# EAGLE schematic dig_usb (EAGLE 6.6.0)

## Sheet 1 of 4
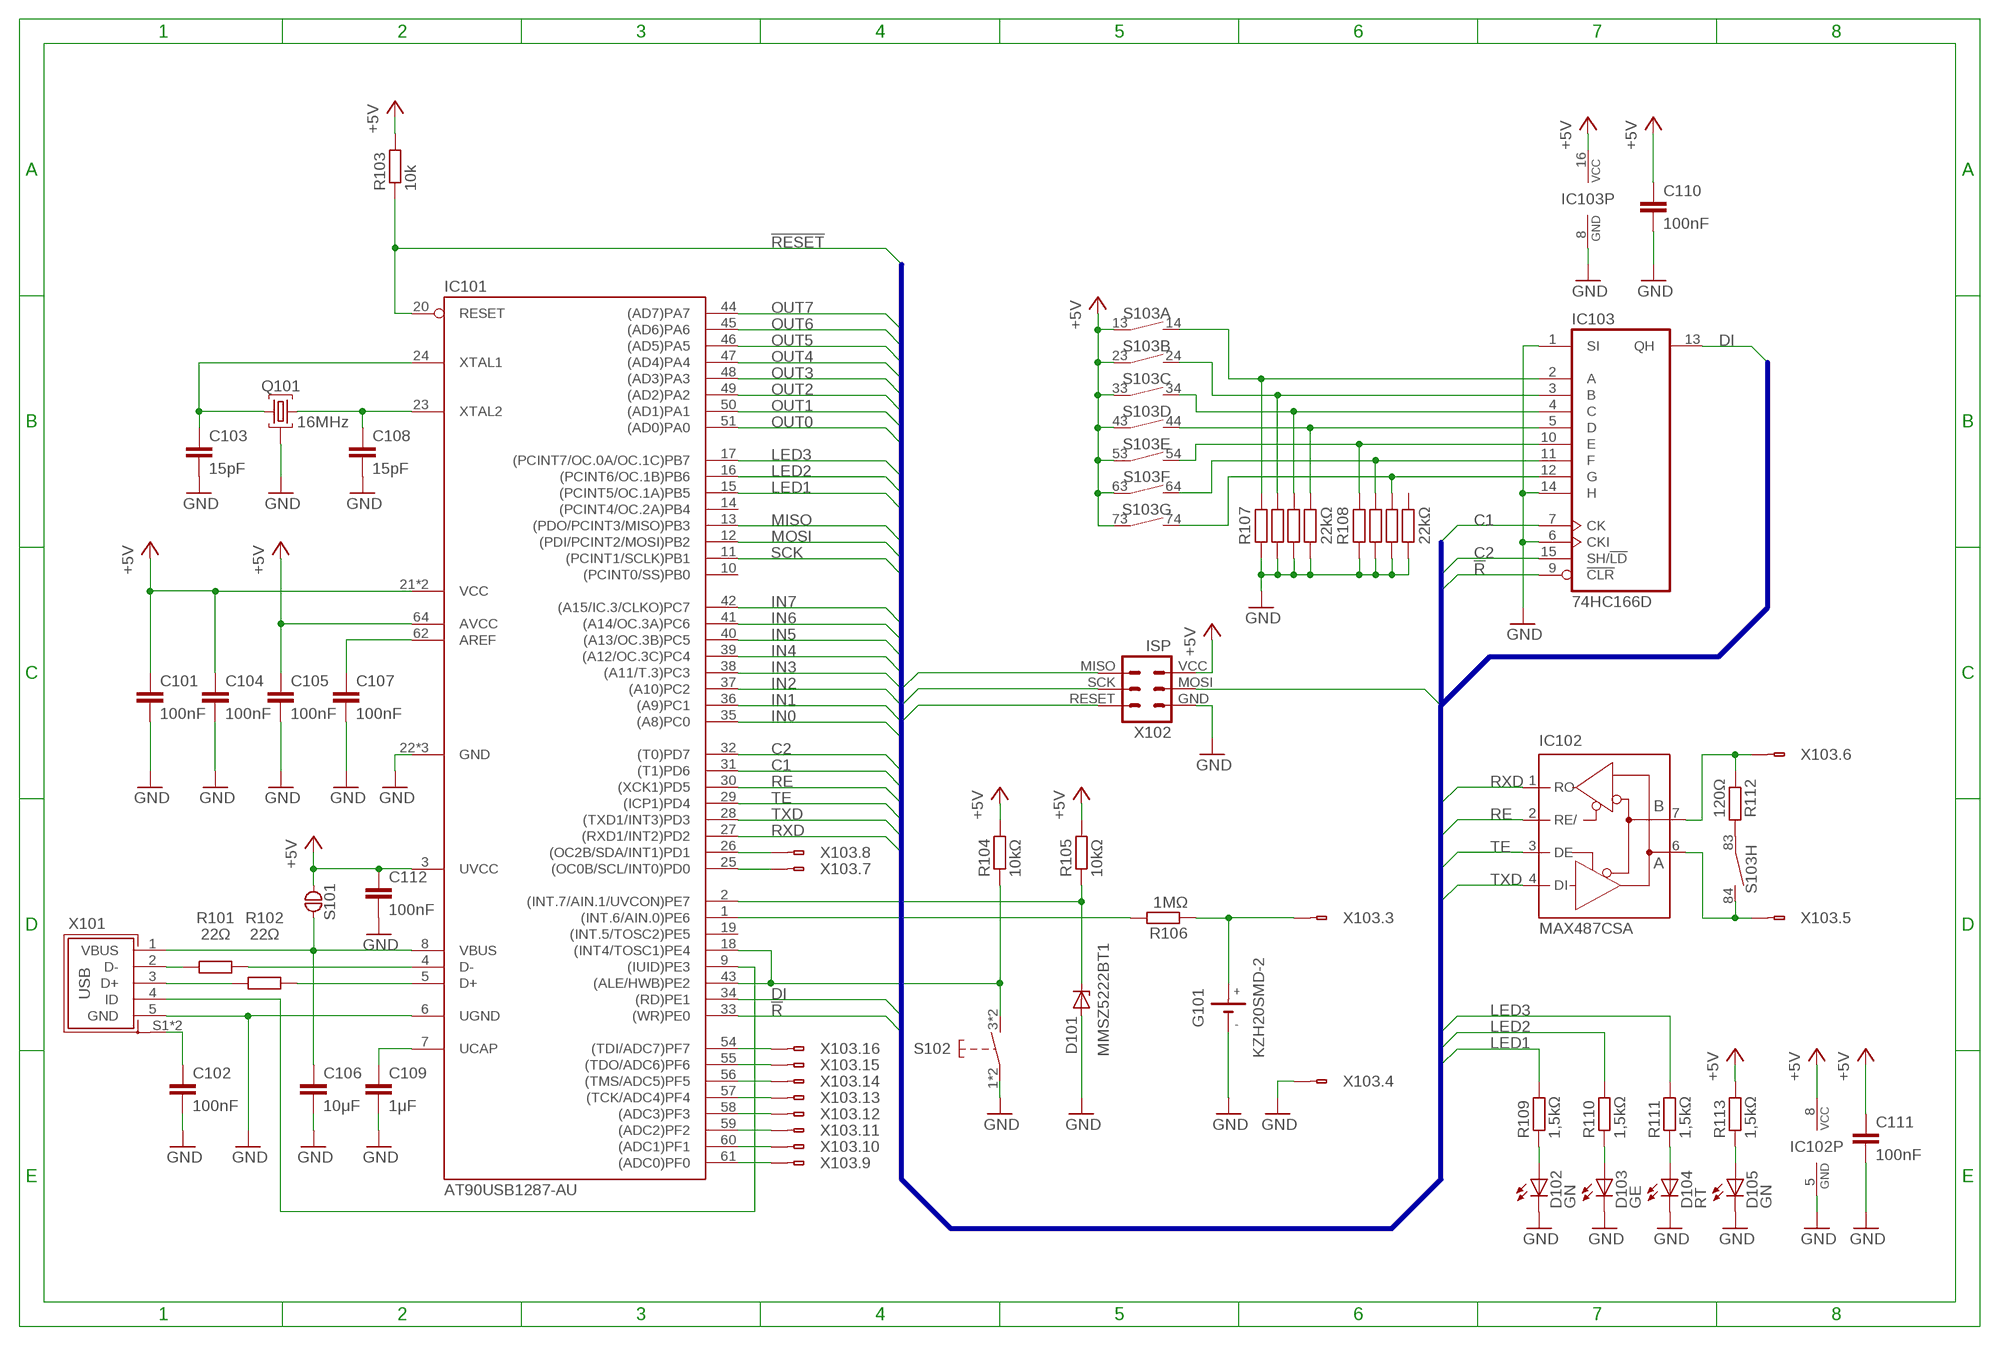
[diagram p0: schematic, sheet 1]

### Parts
C101  100nF  C_0603  [CHIP_0603]
C102  100nF  C_0805  [CHIP_0805]
C103  15pF  C_0805  [CHIP_0805]
C104  100nF  C_0603  [CHIP_0603]
C105  100nF  C_0603  [CHIP_0603]
C106  10μF  C_0805  [CHIP_0805]
C107  100nF  C_0603  [CHIP_0603]
C108  15pF  C_0805  [CHIP_0805]
C109  1μF  C_0805  [CHIP_0805]
C110  100nF  C_0603  [CHIP_0603]
C111  100nF  C_0603  [CHIP_0603]
C112  100nF  C_0603  [CHIP_0603]
D101  MMSZ5222BT1  Z-DIODE-SOD123  [SOD123]
D102  GN  LED_0805  [CHIP_0805]
D103  GE  LED_0805  [CHIP_0805]
D104  RT  LED_0805  [CHIP_0805]
D105  GN  LED_0805  [CHIP_0805]
G101  KZH20SMD-2  [KHZ20SMD-2]
IC101  AT90USB1287-AU  [QFP64_08]
IC102  MAX487CSA  [SOP08_127]
IC103  74HC166D  [SOP16_127]
Q101  16MHz  QM_X22  [X22]
R101  22Ω  R_0805  [CHIP_0805]
R102  22Ω  R_0805  [CHIP_0805]
R103  10k  R_0805  [CHIP_0805]
R104  10kΩ  R_0805  [CHIP_0805]
R105  10kΩ  R_0805  [CHIP_0805]
R106  1MΩ  R_0805  [CHIP_0805]
R107  22kΩ  EXB-38V  [1206]
R108  22kΩ  EXB-38V  [1206]
R109  1,5kΩ  R_0805  [CHIP_0805]
R110  1,5kΩ  R_0805  [CHIP_0805]
R111  1,5kΩ  R_0805  [CHIP_0805]
R112  120Ω  R_0805  [CHIP_0805]
R113  1,5kΩ  R_0805  [CHIP_0805]
S101  JUMPER  [JUMPER2]
S102  KURZHUBS1  [SCHURTER1301]
S103  DP08D  [DIP08_SMD]
X101  USB-MINI-V  [WE651005136421]
X102  ISP  AVR_ISP6  [ML6]
X103  WS34V  [WS34V]

### Nets
!R: IC101.33((WR)PE0) IC103.9(!CLR)
!RESET: IC101.20(RESET) R103.1 X102.RESET
+5V: C101.1 C104.1 C105.1 C110.1 C111.1 C112.1 IC101.3(UVCC) IC101.21(VCC) IC101.52(VCC) IC101.64(AVCC) IC102.8(VCC) IC103.16(VCC) R103.2 R104.2 R105.2 R113.2 S101.P$1 S103.13 S103.23 S103.33 S103.43 S103.53 S103.63 S103.73 X102.VCC ; also sheet 2,3,4
C1: IC101.31((T1)PD6) IC103.7(CK)
C2: IC101.32((T0)PD7) IC103.15(SH/!LD)
DI: IC101.34((RD)PE1) IC103.13(QH)
GND: C101.2 C102.2 C103.2 C104.2 C105.2 C106.2 C107.2 C108.2 C109.2 C110.2 C111.2 C112.2 D101.A D102.2(C) D103.2(C) D104.2(C) D105.2(C) G101.- IC101.6(UGND) IC101.22(GND) IC101.53(GND) IC101.63(GND) IC102.5(GND) IC103.1(SI) IC103.6(CKI) IC103.8(GND) IC103.14(H) Q101.2(G) Q101.4(G) R107.1A R107.2A R107.3A R107.4A R108.1A R108.2A R108.3A R108.4A S102.1(P) S102.2(P) X101.5(GND) X102.GND X103.4 ; also sheet 2,3,4
IN0: IC101.35((A8)PC0) ; also sheet 2
IN1: IC101.36((A9)PC1) ; also sheet 2
IN2: IC101.37((A10)PC2) ; also sheet 2
IN3: IC101.38((A11/T.3)PC3) ; also sheet 2
IN4: IC101.39((A12/OC.3C)PC4) ; also sheet 2
IN5: IC101.40((A13/OC.3B)PC5) ; also sheet 2
IN6: IC101.41((A14/OC.3A)PC6) ; also sheet 2
IN7: IC101.42((A15/IC.3/CLKO)PC7) ; also sheet 2
LED1: IC101.15((PCINT5/OC.1A)PB5) R109.2
LED2: IC101.16((PCINT6/OC.1B)PB6) R110.2
LED3: IC101.17((PCINT7/OC.0A/OC.1C)PB7) R111.2
MISO: IC101.13((PDO/PCINT3/MISO)PB3) X102.MISO
MOSI: IC101.12((PDI/PCINT2/MOSI)PB2) X102.MOSI
N$4: D104.1(A) R111.1
N$12: C107.1 IC101.62(AREF)
N$20: IC102.6(A) S103.84 X103.5
N$21: IC101.1((INT.6/AIN.0)PE6) R106.2
N$22: IC102.7(B) R112.1 X103.6
N$26: IC103.2(A) R107.1B S103.14
N$27: IC103.3(B) R107.2B S103.24
N$28: IC103.4(C) R107.3B S103.34
N$29: IC103.5(D) R107.4B S103.44
N$30: IC103.10(E) R108.1B S103.54
N$31: IC103.11(F) R108.2B S103.64
N$32: IC103.12(G) R108.3B S103.74
N$33: R112.2 S103.83
N$44: D105.1(A) R113.1
N$62: D102.1(A) R109.1
N$63: D103.1(A) R110.1
N$118: C109.1 IC101.7(UCAP)
N$119: R102.1 X101.3(D+)
N$120: IC101.5(D+) R102.2
N$121: R101.1 X101.2(D-)
N$122: IC101.4(D-) R101.2
N$123: IC101.9((IUID)PE3) X101.4(ID)
N$124: C106.1 IC101.8(VBUS) S101.P$2 X101.1(VBUS)
N$125: C108.1 IC101.23(XTAL2) Q101.3
N$128: C103.1 IC101.24(XTAL1) Q101.1
N$129: D101.K IC101.2((INT.7/AIN.1/UVCON)PE7) R105.1
N$135: IC101.61((ADC0)PF0) X103.9
N$136: IC101.60((ADC1)PF1) X103.10
N$137: IC101.59((ADC2)PF2) X103.11
N$138: IC101.58((ADC3)PF3) X103.12
N$139: IC101.57((TCK/ADC4)PF4) X103.13
N$140: IC101.56((TMS/ADC5)PF5) X103.14
N$141: IC101.55((TDO/ADC6)PF6) X103.15
N$142: IC101.54((TDI/ADC7)PF7) X103.16
N$143: G101.+ R106.1 X103.3
N$144: IC101.25((OC0B/SCL/INT0)PD0) X103.7
N$145: IC101.26((OC2B/SDA/INT1)PD1) X103.8
N$147: IC101.18((INT4/TOSC1)PE4) IC101.43((ALE/HWB)PE2) R104.1 S102.3(S) S102.4(S)
OUT0: IC101.51((AD0)PA0) ; also sheet 2
OUT1: IC101.50((AD1)PA1) ; also sheet 2
OUT2: IC101.49((AD2)PA2) ; also sheet 2
OUT3: IC101.48((AD3)PA3) ; also sheet 2
OUT4: IC101.47((AD4)PA4) ; also sheet 2
OUT5: IC101.46((AD5)PA5) ; also sheet 2
OUT6: IC101.45((AD6)PA6) ; also sheet 2
OUT7: IC101.44((AD7)PA7) ; also sheet 2
RE: IC101.30((XCK1)PD5) IC102.2(RE/)
RXD: IC101.27((RXD1/INT2)PD2) IC102.1(RO)
SCK: IC101.11((PCINT1/SCLK)PB1) X102.SCK
TE: IC101.29((ICP1)PD4) IC102.3(DE)
TXD: IC101.28((TXD1/INT3)PD3) IC102.4(DI)
USHIELD: C102.1 X101.S1(SHIELD) X101.S2(SHIELD)
Unconnected: IC101.10((PCINT0/SS)PB0) IC101.14((PCINT4/OC.2A)PB4) IC101.19((INT.5/TOSC2)PE5) R108.4B

### Buses
IN[0..7],OUT[0..7],LED[1..3],C1,C2,DI,!R,RXD,TXD,RE,TE,SCL,SDA,ALARM1,ALARM2,MISO,MOSI,SCK,!RESET

## Sheet 2 of 4
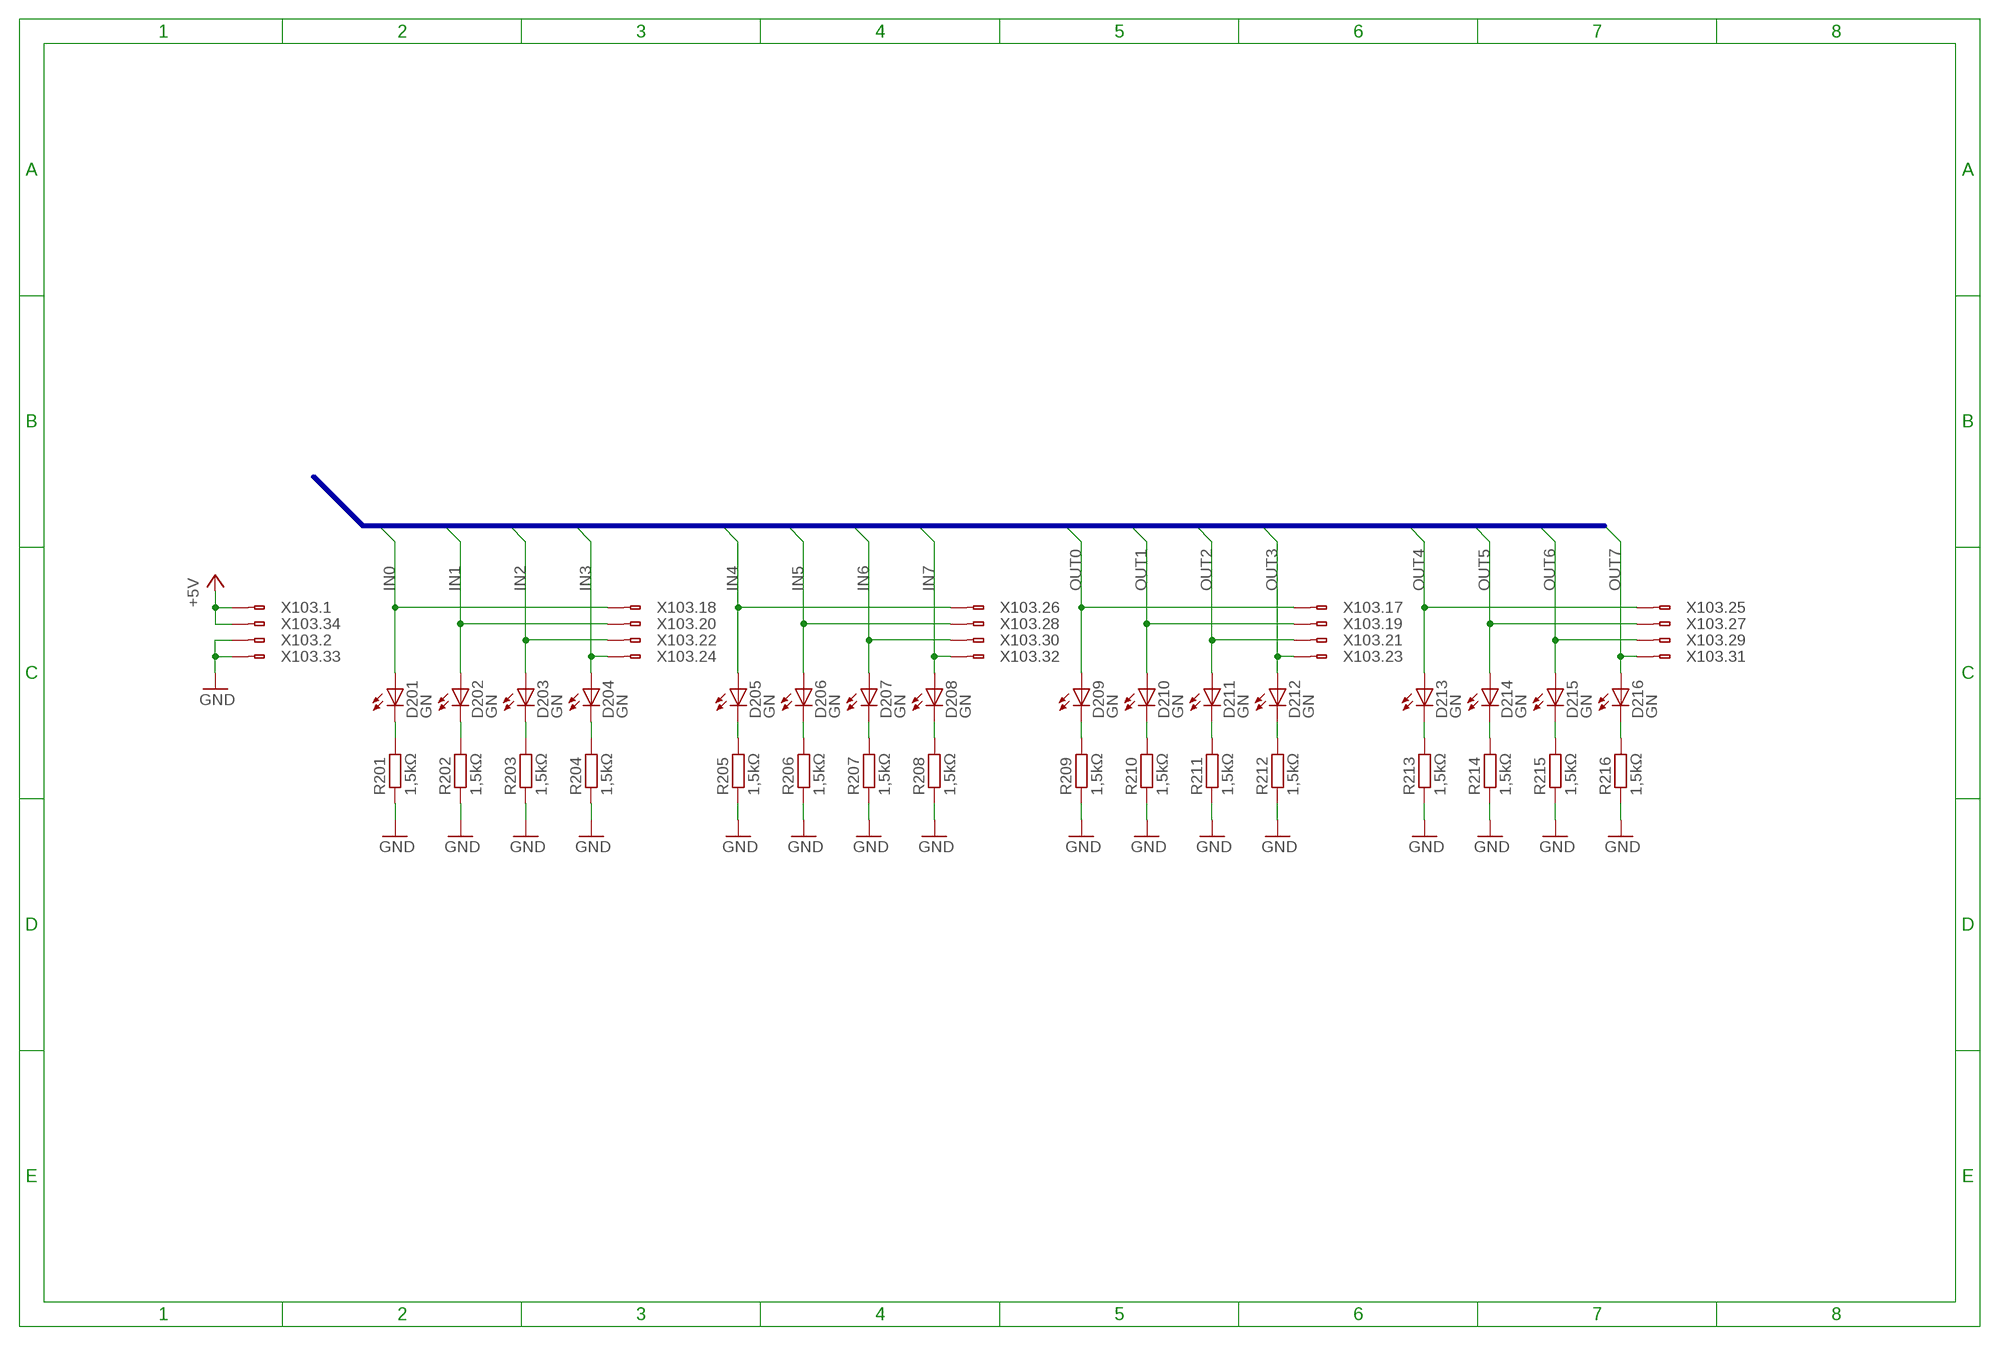
[diagram p1: schematic, sheet 2]

### Parts
D201  GN  LED_0805  [CHIP_0805]
D202  GN  LED_0805  [CHIP_0805]
D203  GN  LED_0805  [CHIP_0805]
D204  GN  LED_0805  [CHIP_0805]
D205  GN  LED_0805  [CHIP_0805]
D206  GN  LED_0805  [CHIP_0805]
D207  GN  LED_0805  [CHIP_0805]
D208  GN  LED_0805  [CHIP_0805]
D209  GN  LED_0805  [CHIP_0805]
D210  GN  LED_0805  [CHIP_0805]
D211  GN  LED_0805  [CHIP_0805]
D212  GN  LED_0805  [CHIP_0805]
D213  GN  LED_0805  [CHIP_0805]
D214  GN  LED_0805  [CHIP_0805]
D215  GN  LED_0805  [CHIP_0805]
D216  GN  LED_0805  [CHIP_0805]
R201  1,5kΩ  R_0805  [CHIP_0805]
R202  1,5kΩ  R_0805  [CHIP_0805]
R203  1,5kΩ  R_0805  [CHIP_0805]
R204  1,5kΩ  R_0805  [CHIP_0805]
R205  1,5kΩ  R_0805  [CHIP_0805]
R206  1,5kΩ  R_0805  [CHIP_0805]
R207  1,5kΩ  R_0805  [CHIP_0805]
R208  1,5kΩ  R_0805  [CHIP_0805]
R209  1,5kΩ  R_0805  [CHIP_0805]
R210  1,5kΩ  R_0805  [CHIP_0805]
R211  1,5kΩ  R_0805  [CHIP_0805]
R212  1,5kΩ  R_0805  [CHIP_0805]
R213  1,5kΩ  R_0805  [CHIP_0805]
R214  1,5kΩ  R_0805  [CHIP_0805]
R215  1,5kΩ  R_0805  [CHIP_0805]
R216  1,5kΩ  R_0805  [CHIP_0805]

### Nets
+5V: X103.1 X103.34 ; also sheet 1,3,4
GND: R201.1 R202.1 R203.1 R204.1 R205.1 R206.1 R207.1 R208.1 R209.1 R210.1 R211.1 R212.1 R213.1 R214.1 R215.1 R216.1 X103.2 X103.33 ; also sheet 1,3,4
IN0: D201.1(A) X103.18 ; also sheet 1
IN1: D202.1(A) X103.20 ; also sheet 1
IN2: D203.1(A) X103.22 ; also sheet 1
IN3: D204.1(A) X103.24 ; also sheet 1
IN4: D205.1(A) X103.26 ; also sheet 1
IN5: D206.1(A) X103.28 ; also sheet 1
IN6: D207.1(A) X103.30 ; also sheet 1
IN7: D208.1(A) X103.32 ; also sheet 1
N$102: D201.2(C) R201.2
N$103: D202.2(C) R202.2
N$104: D203.2(C) R203.2
N$105: D204.2(C) R204.2
N$106: D205.2(C) R205.2
N$107: D206.2(C) R206.2
N$108: D207.2(C) R207.2
N$109: D208.2(C) R208.2
N$110: D209.2(C) R209.2
N$111: D210.2(C) R210.2
N$112: D211.2(C) R211.2
N$113: D212.2(C) R212.2
N$114: D213.2(C) R213.2
N$115: D214.2(C) R214.2
N$116: D215.2(C) R215.2
N$117: D216.2(C) R216.2
OUT0: D209.1(A) X103.17 ; also sheet 1
OUT1: D210.1(A) X103.19 ; also sheet 1
OUT2: D211.1(A) X103.21 ; also sheet 1
OUT3: D212.1(A) X103.23 ; also sheet 1
OUT4: D213.1(A) X103.25 ; also sheet 1
OUT5: D214.1(A) X103.27 ; also sheet 1
OUT6: D215.1(A) X103.29 ; also sheet 1
OUT7: D216.1(A) X103.31 ; also sheet 1

### Buses
IN[0..7],OUT[0..7],LED[1..3],C1,C2,DI,!R,RXD,TXD,RE,TE,SCL,SDA,ALARM1,ALARM2,MISO,MOSI,SCK,!RESET

## Sheet 3 of 4
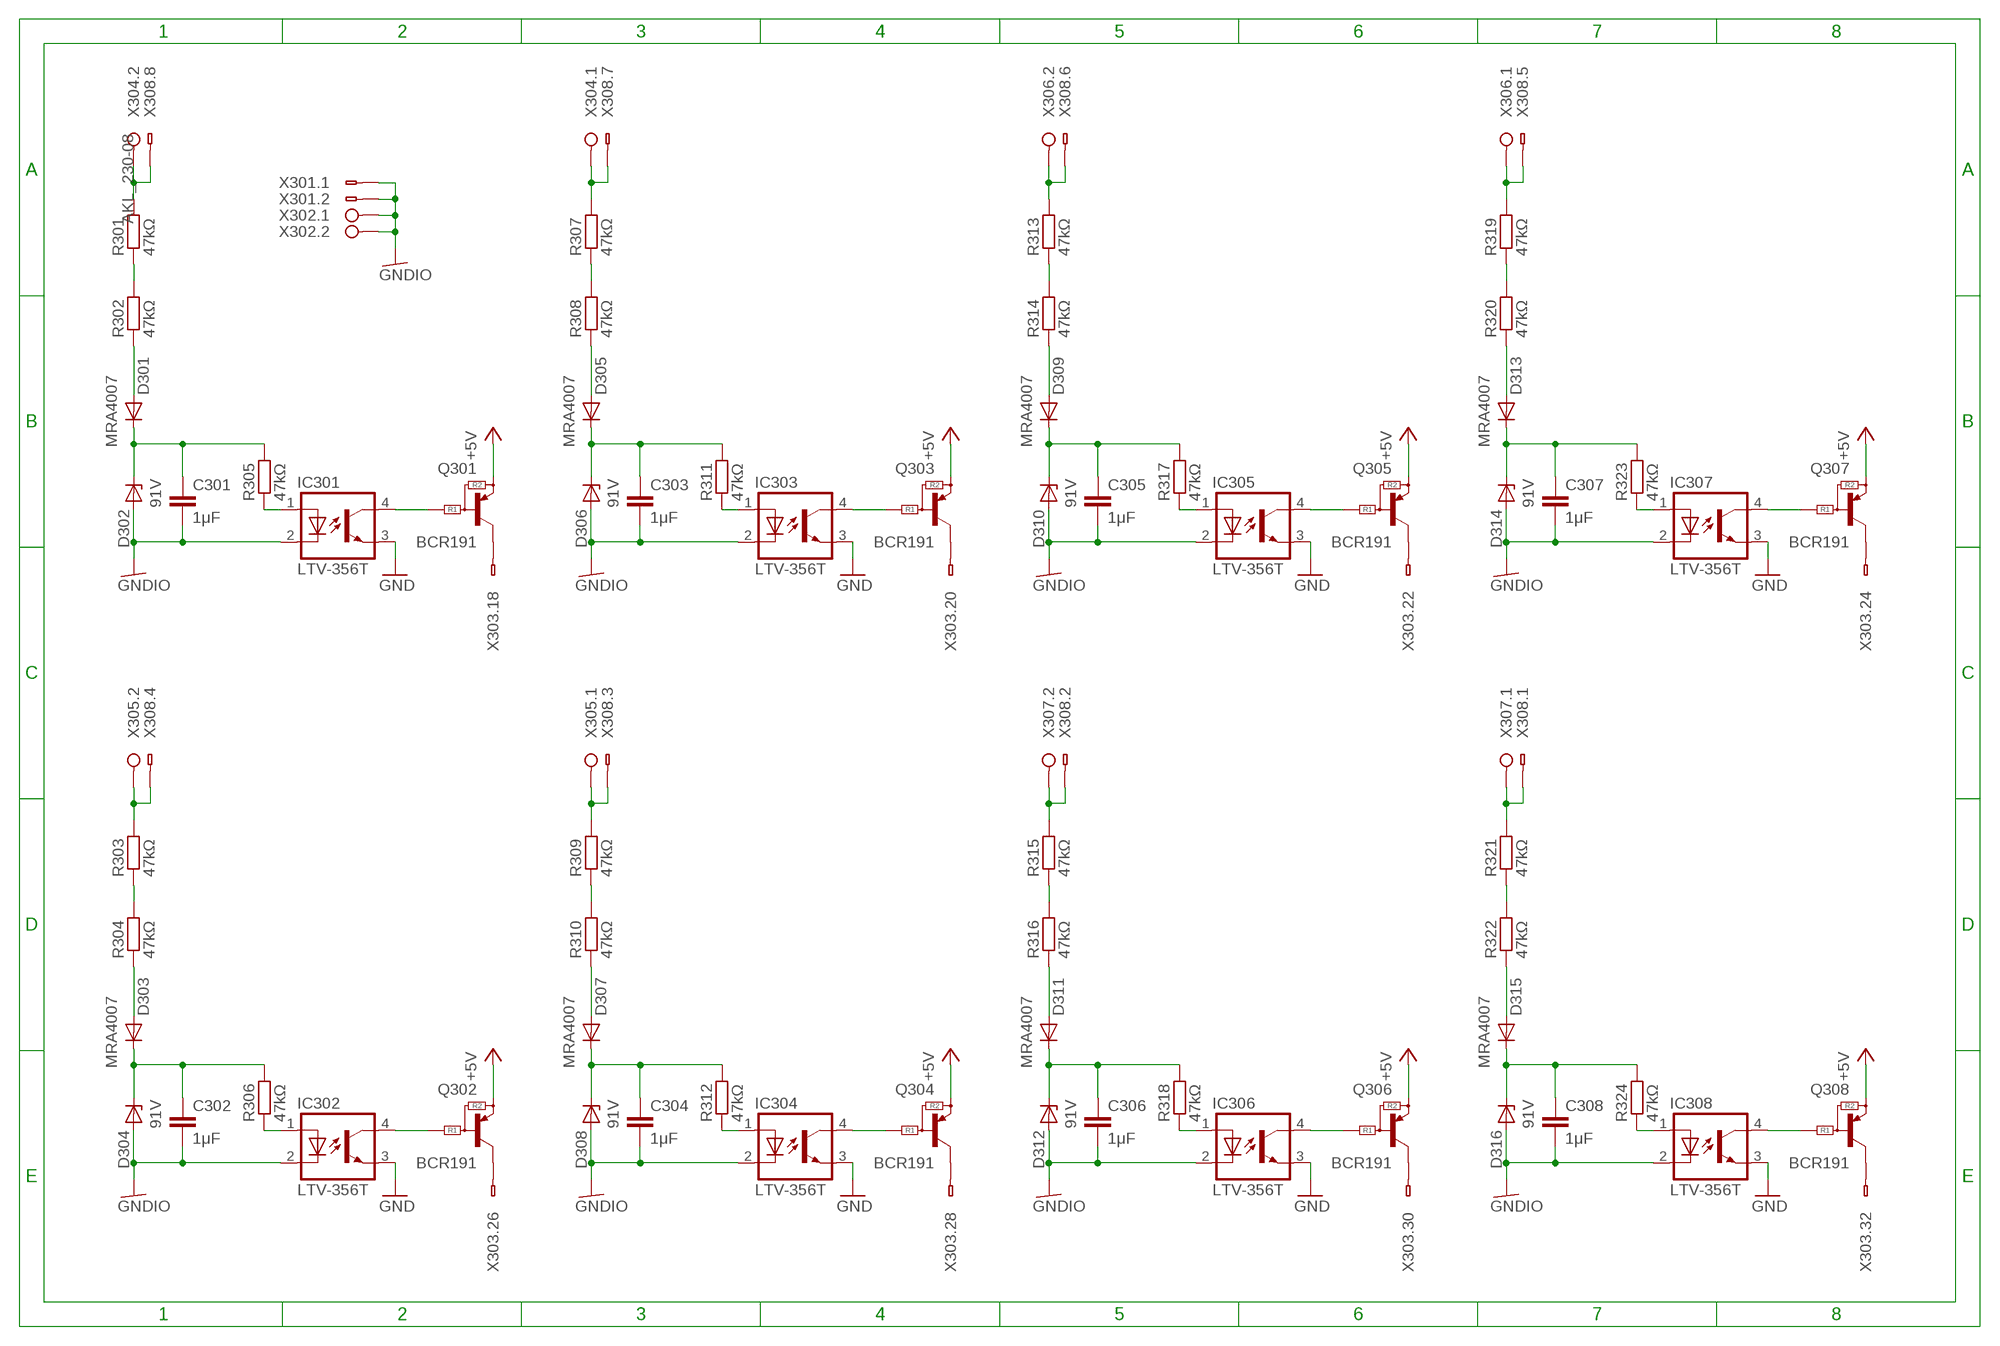
[diagram p2: schematic, sheet 3]

### Parts
C301  1μF  C_1206  [CHIP_1206]
C302  1μF  C_1206  [CHIP_1206]
C303  1μF  C_1206  [CHIP_1206]
C304  1μF  C_1206  [CHIP_1206]
C305  1μF  C_1206  [CHIP_1206]
C306  1μF  C_1206  [CHIP_1206]
C307  1μF  C_1206  [CHIP_1206]
C308  1μF  C_1206  [CHIP_1206]
D301  MRA4007  DIODE-DO214AC  [DO214AC]
D302  91V  Z-DIODE-SOD123  [SOD123]
D303  MRA4007  DIODE-DO214AC  [DO214AC]
D304  91V  Z-DIODE-SOD123  [SOD123]
D305  MRA4007  DIODE-DO214AC  [DO214AC]
D306  91V  Z-DIODE-SOD123  [SOD123]
D307  MRA4007  DIODE-DO214AC  [DO214AC]
D308  91V  Z-DIODE-SOD123  [SOD123]
D309  MRA4007  DIODE-DO214AC  [DO214AC]
D310  91V  Z-DIODE-SOD123  [SOD123]
D311  MRA4007  DIODE-DO214AC  [DO214AC]
D312  91V  Z-DIODE-SOD123  [SOD123]
D313  MRA4007  DIODE-DO214AC  [DO214AC]
D314  91V  Z-DIODE-SOD123  [SOD123]
D315  MRA4007  DIODE-DO214AC  [DO214AC]
D316  91V  Z-DIODE-SOD123  [SOD123]
IC301  LTV-356T  [SOP04_254]
IC302  LTV-356T  [SOP04_254]
IC303  LTV-356T  [SOP04_254]
IC304  LTV-356T  [SOP04_254]
IC305  LTV-356T  [SOP04_254]
IC306  LTV-356T  [SOP04_254]
IC307  LTV-356T  [SOP04_254]
IC308  LTV-356T  [SOP04_254]
Q301  BCR191  PNP2R-SOT23-BEC  [SOT23]
Q302  BCR191  PNP2R-SOT23-BEC  [SOT23]
Q303  BCR191  PNP2R-SOT23-BEC  [SOT23]
Q304  BCR191  PNP2R-SOT23-BEC  [SOT23]
Q305  BCR191  PNP2R-SOT23-BEC  [SOT23]
Q306  BCR191  PNP2R-SOT23-BEC  [SOT23]
Q307  BCR191  PNP2R-SOT23-BEC  [SOT23]
Q308  BCR191  PNP2R-SOT23-BEC  [SOT23]
R301  47kΩ  R_1206  [CHIP_1206]
R302  47kΩ  R_1206  [CHIP_1206]
R303  47kΩ  R_1206  [CHIP_1206]
R304  47kΩ  R_1206  [CHIP_1206]
R305  47kΩ  R_1206  [CHIP_1206]
R306  47kΩ  R_1206  [CHIP_1206]
R307  47kΩ  R_1206  [CHIP_1206]
R308  47kΩ  R_1206  [CHIP_1206]
R309  47kΩ  R_1206  [CHIP_1206]
R310  47kΩ  R_1206  [CHIP_1206]
R311  47kΩ  R_1206  [CHIP_1206]
R312  47kΩ  R_1206  [CHIP_1206]
R313  47kΩ  R_1206  [CHIP_1206]
R314  47kΩ  R_1206  [CHIP_1206]
R315  47kΩ  R_1206  [CHIP_1206]
R316  47kΩ  R_1206  [CHIP_1206]
R317  47kΩ  R_1206  [CHIP_1206]
R318  47kΩ  R_1206  [CHIP_1206]
R319  47kΩ  R_1206  [CHIP_1206]
R320  47kΩ  R_1206  [CHIP_1206]
R321  47kΩ  R_1206  [CHIP_1206]
R322  47kΩ  R_1206  [CHIP_1206]
R323  47kΩ  R_1206  [CHIP_1206]
R324  47kΩ  R_1206  [CHIP_1206]
X301  AKL_230-02  [AKL_230-02]
X302  RIA-73-02  [RIA-73-02]
X303  WS34V  [WS34V]
X304  RIA-73-02  [RIA-73-02]
X305  RIA-73-02  [RIA-73-02]
X306  RIA-73-02  [RIA-73-02]
X307  RIA-73-02  [RIA-73-02]
X308  AKL_230-08  [AKL_230-08]

### Nets
+5V: Q301.2(E) Q302.2(E) Q303.2(E) Q304.2(E) Q305.2(E) Q306.2(E) Q307.2(E) Q308.2(E) ; also sheet 1,2,4
GND: IC301.3(E) IC302.3(E) IC303.3(E) IC304.3(E) IC305.3(E) IC306.3(E) IC307.3(E) IC308.3(E) ; also sheet 1,2,4
GNDIO [netz]: C301.2 C302.2 C303.2 C304.2 C305.2 C306.2 C307.2 C308.2 D302.A D304.A D306.A D308.A D310.A D312.A D314.A D316.A IC301.2(K) IC302.2(K) IC303.2(K) IC304.2(K) IC305.2(K) IC306.2(K) IC307.2(K) IC308.2(K) X301.P$1 X301.P$2 X302.1 X302.2 ; also sheet 4
N$1 [netz]: R301.1 R302.2
N$2 [netz]: D301.A R302.1
N$3 [netz]: C301.1 D301.K D302.K R305.2
N$5 [netz]: IC301.1(A) R305.1
N$6 [netz]: D305.A R308.1
N$7 [netz]: C303.1 D305.K D306.K R311.2
N$9 [netz]: IC303.1(A) R311.1
N$10 [netz]: D309.A R314.1
N$11 [netz]: C305.1 D309.K D310.K R317.2
N$13 [netz]: IC305.1(A) R317.1
N$14 [netz]: D313.A R320.1
N$15 [netz]: C307.1 D313.K D314.K R323.2
N$17 [netz]: R307.1 R308.2
N$18 [netz]: R313.1 R314.2
N$34 [netz]: IC307.1(A) R323.1
N$35 [netz]: D303.A R304.1
N$36 [netz]: C302.1 D303.K D304.K R306.2
N$38 [netz]: IC302.1(A) R306.1
N$39 [netz]: D307.A R310.1
N$40 [netz]: C304.1 D307.K D308.K R312.2
N$43 [netz]: R319.1 R320.2
N$45 [netz]: R307.2 X304.1 X308.P$7
N$46 [netz]: R301.2 X304.2 X308.P$8
N$47 [netz]: R319.2 X306.1 X308.P$5
N$48 [netz]: R313.2 X306.2 X308.P$6
N$49 [netz]: R303.1 R304.2
N$51 [netz]: R309.1 R310.2
N$52: IC307.4(C) Q307.1(B)
N$53 [netz]: R315.1 R316.2
N$54 [netz]: R321.1 R322.2
N$55 [netz]: IC304.1(A) R312.1
N$56 [netz]: R303.2 X305.2 X308.P$4
N$57 [netz]: D311.A R316.1
N$58 [netz]: R309.2 X305.1 X308.P$3
N$59 [netz]: R321.2 X307.1 X308.P$1
N$60 [netz]: R315.2 X307.2 X308.P$2
N$65 [netz]: C306.1 D311.K D312.K R318.2
N$69 [netz]: IC306.1(A) R318.1
N$70: IC305.4(C) Q305.1(B)
N$71 [netz]: D315.A R322.1
N$73: IC303.4(C) Q303.1(B)
N$75: IC301.4(C) Q301.1(B)
N$77 [netz]: C308.1 D315.K D316.K R324.2
N$80: IC302.4(C) Q302.1(B)
N$81: IC304.4(C) Q304.1(B)
N$83: IC306.4(C) Q306.1(B)
N$85: IC308.4(C) Q308.1(B)
N$86 [netz]: IC308.1(A) R324.1
N$94: Q301.3(C) X303.18
N$95: Q303.3(C) X303.20
N$96: Q305.3(C) X303.22
N$97: Q307.3(C) X303.24
N$98: Q302.3(C) X303.26
N$99: Q304.3(C) X303.28
N$100: Q306.3(C) X303.30
N$101: Q308.3(C) X303.32

## Sheet 4 of 4
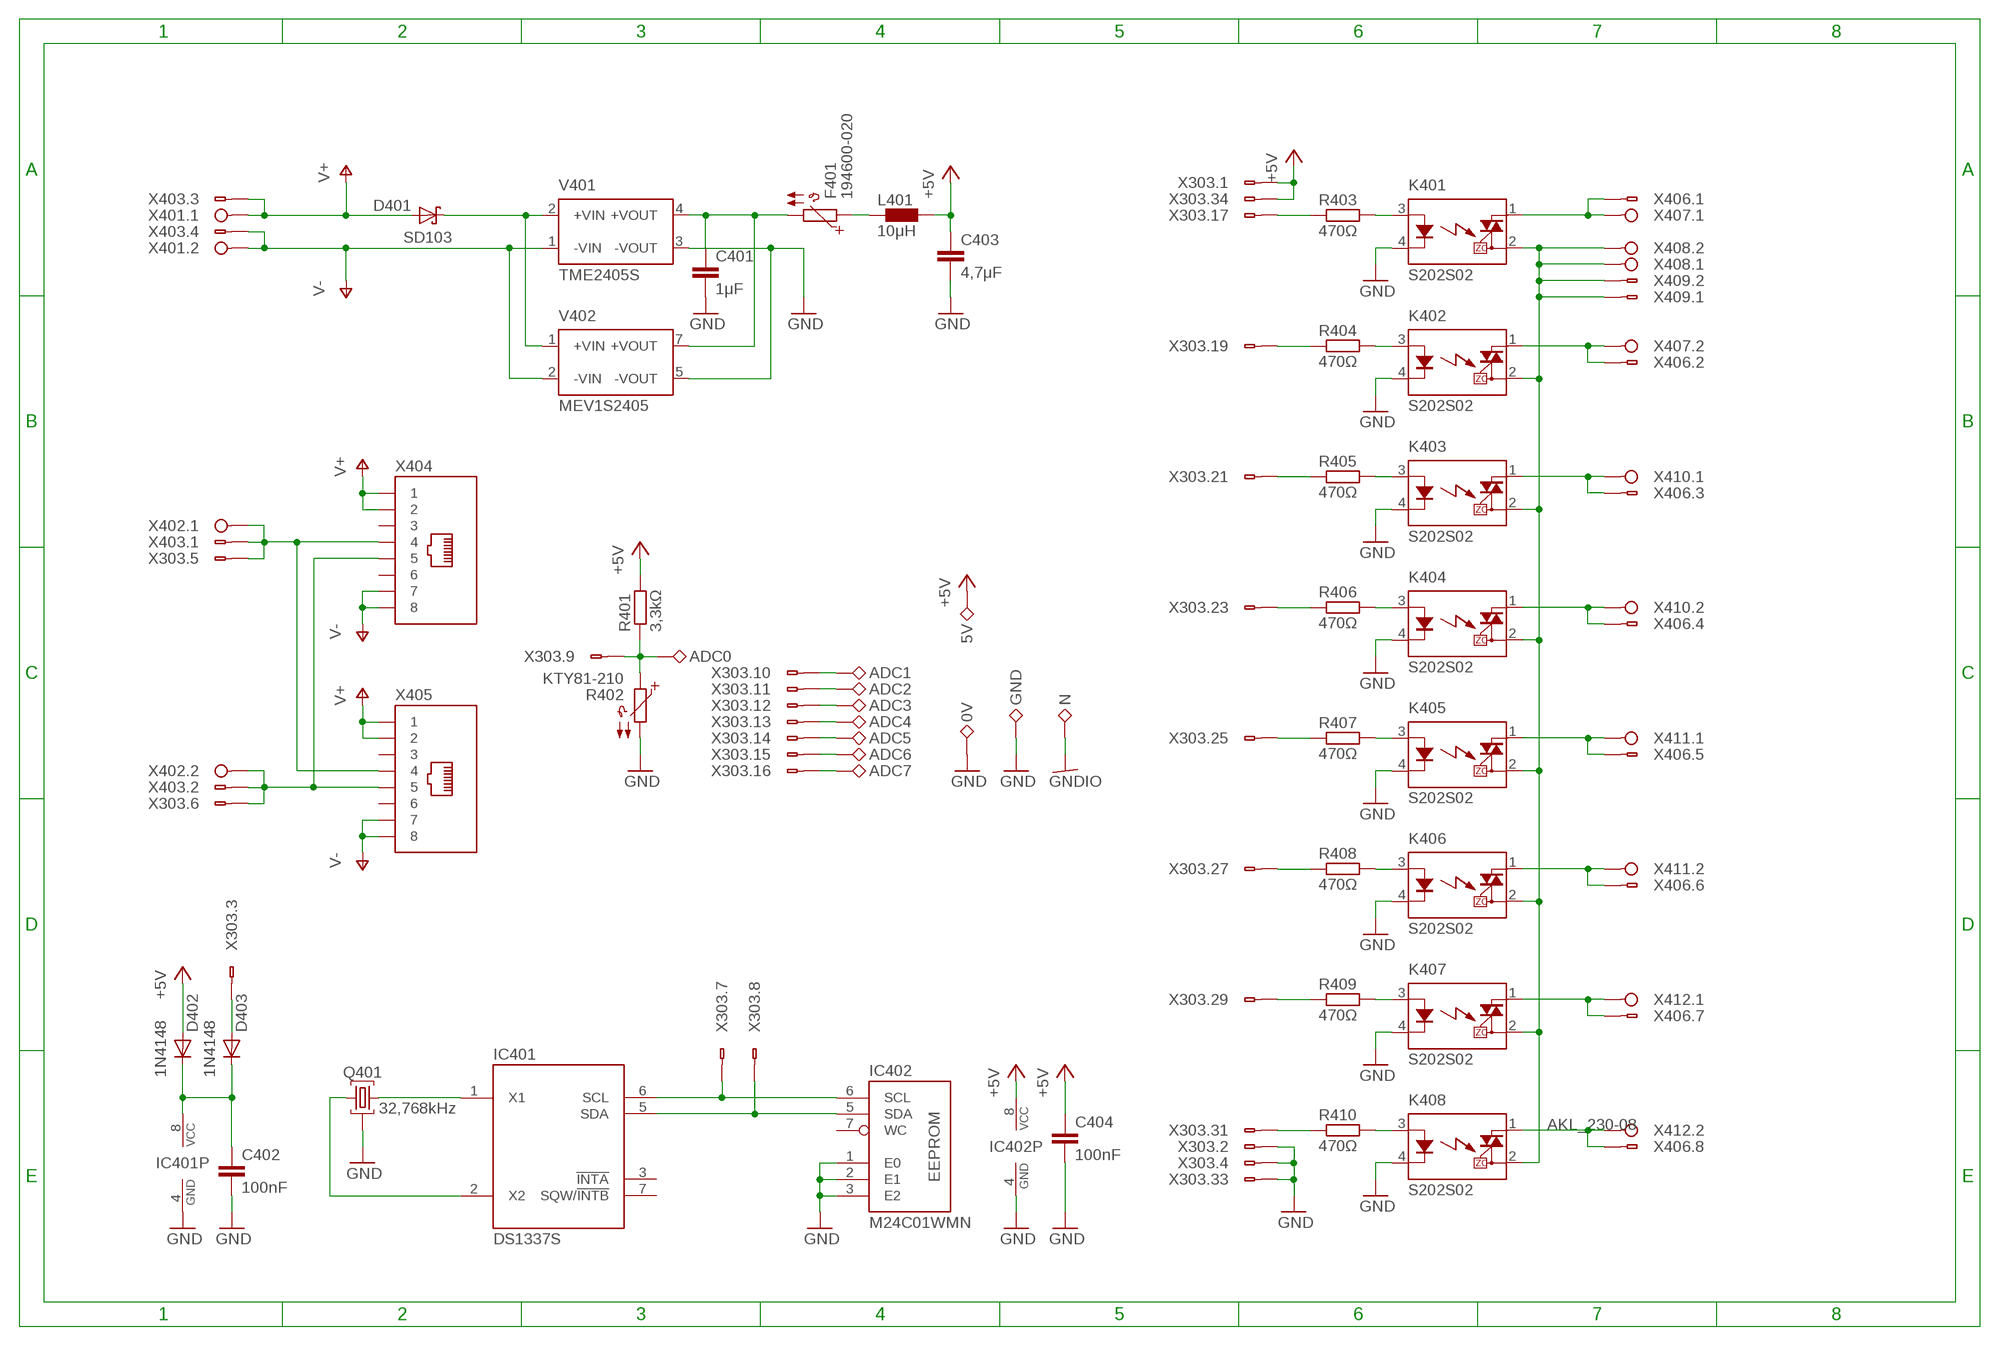
[diagram p3: schematic, sheet 4]

### Parts
0V  TEST_VIA_08  [VIA08]
5V  TEST_VIA_08  [VIA08]
ADC0  TEST_PAD_SMALL  [PADS]
ADC1  TEST_PAD_SMALL  [PADS]
ADC2  TEST_PAD_SMALL  [PADS]
ADC3  TEST_PAD_SMALL  [PADS]
ADC4  TEST_PAD_SMALL  [PADS]
ADC5  TEST_PAD_SMALL  [PADS]
ADC6  TEST_PAD_SMALL  [PADS]
ADC7  TEST_PAD_SMALL  [PADS]
C401  1μF  C_0805  [CHIP_0805]
C402  100nF  C_0603  [CHIP_0603]
C403  4,7μF  C_0805  [CHIP_0805]
C404  100nF  C_0603  [CHIP_0603]
D401  SD103  SHOTKY-DIODE-SOD123  [SOD123]
D402  1N4148  DIODE-SOD123  [SOD123]
D403  1N4148  DIODE-SOD123  [SOD123]
F401  194600-020  [CHIP_1812]
GND  TEST_VIA_08  [VIA08]
IC401  DS1337S  [SOP08_127]
IC402  M24C01WMN  [SOP08_127]
K401  S202S02  [SIP4]
K402  S202S02  [SIP4]
K403  S202S02  [SIP4]
K404  S202S02  [SIP4]
K405  S202S02  [SIP4]
K406  S202S02  [SIP4]
K407  S202S02  [SIP4]
K408  S202S02  [SIP4]
L401  10μH  L_1812AF  [1812AF]
N  TEST_VIA_08  [VIA08]
Q401  32,768kHz  QM_MS1V-T1K  [MS1V-T1K]
R401  3,3kΩ  R_0805  [CHIP_0805]
R402  KTY81-210  [TO92]
R403  470Ω  R_0805  [CHIP_0805]
R404  470Ω  R_0805  [CHIP_0805]
R405  470Ω  R_0805  [CHIP_0805]
R406  470Ω  R_0805  [CHIP_0805]
R407  470Ω  R_0805  [CHIP_0805]
R408  470Ω  R_0805  [CHIP_0805]
R409  470Ω  R_0805  [CHIP_0805]
R410  470Ω  R_0805  [CHIP_0805]
V401  TME2405S  [TME-24V]
V402  MEV1S2405  [MEV1S]
X401  RIA-73-02  [RIA-73-02]
X402  RIA-73-02  [RIA-73-02]
X403  AKL_230-04  [AKL_230-04]
X404  8P8C  [C-BMJ-0102]
X405  8P8C  [C-BMJ-0102]
X406  AKL_230-08  [AKL_230-08]
X407  RIA-73-02  [RIA-73-02]
X408  RIA-73-02  [RIA-73-02]
X409  AKL_230-02  [AKL_230-02]
X410  RIA-73-02  [RIA-73-02]
X411  RIA-73-02  [RIA-73-02]
X412  RIA-73-02  [RIA-73-02]

### Nets
+5V: 5V.1 C403.1 C404.1 D402.A IC402.8(VCC) L401.1 R401.2 X303.1 X303.34 ; also sheet 1,2,3
GND: 0V.1 C401.2 C402.2 C403.2 C404.2 GND.1 IC401.4(GND) IC402.1(E0) IC402.2(E1) IC402.3(E2) IC402.4(GND) K401.4(K) K402.4(K) K403.4(K) K404.4(K) K405.4(K) K406.4(K) K407.4(K) K408.4(K) Q401.G R402.2 V401.3(-VOUT) V402.5(-VOUT) X303.2 X303.4 X303.33 ; also sheet 1,2,3
GNDIO [netz]: N.1 ; also sheet 3
L [netz]: K401.2(DS2) K402.2(DS2) K403.2(DS2) K404.2(DS2) K405.2(DS2) K406.2(DS2) K407.2(DS2) K408.2(DS2) X408.1 X408.2 X409.P$1 X409.P$2
N$8: K401.3(A) R403.2
N$16: K402.3(A) R404.2
N$19: C401.1 F401.2 V401.4(+VOUT) V402.7(+VOUT)
N$23 [buspower]: D401.K V401.2(+VIN) V402.1(+VIN)
N$24: F401.1 L401.2
N$25: K403.3(A) R405.2
N$37: K404.3(A) R406.2
N$41: ADC1.1 X303.10
N$42: K405.3(A) R407.2
N$50: K406.3(A) R408.2
N$61: K407.3(A) R409.2
N$64: C402.1 D402.K D403.K IC401.8(VCC)
N$66: K408.3(A) R410.2
N$67: R403.1 X303.17
N$68 [netz]: K401.1(DS1) X406.P$1 X407.1
N$72 [netz]: K402.1(DS1) X406.P$2 X407.2
N$74 [netz]: K403.1(DS1) X406.P$3 X410.1
N$76 [netz]: K404.1(DS1) X406.P$4 X410.2
N$78 [netz]: K405.1(DS1) X406.P$5 X411.1
N$79: R404.1 X303.19
N$82 [netz]: K406.1(DS1) X406.P$6 X411.2
N$84 [netz]: K407.1(DS1) X406.P$7 X412.1
N$87: R405.1 X303.21
N$88: R406.1 X303.23
N$89 [netz]: K408.1(DS1) X406.P$8 X412.2
N$90: R407.1 X303.25
N$91: R408.1 X303.27
N$92: R409.1 X303.29
N$93: R410.1 X303.31
N$126: IC401.1(X1) Q401.2
N$127: IC401.2(X2) Q401.1
N$130: D403.A X303.3
N$131: IC401.6(SCL) IC402.6(SCL) X303.7
N$132: IC401.5(SDA) IC402.5(SDA) X303.8
N$133: X303.6 X402.2 X403.P$2 X404.P$5 X405.P$5
N$134: X303.5 X402.1 X403.P$1 X404.P$4 X405.P$4
N$146: ADC0.1 R401.1 R402.1 X303.9
N$148: ADC2.1 X303.11
N$149: ADC3.1 X303.12
N$150: ADC4.1 X303.13
N$151: ADC5.1 X303.14
N$152: ADC6.1 X303.15
N$153: ADC7.1 X303.16
V+ [buspower]: D401.A X401.1 X403.P$3 X404.P$1 X404.P$2 X405.P$1 X405.P$2
V- [buspower]: V401.1(-VIN) V402.2(-VIN) X401.2 X403.P$4 X404.P$7 X404.P$8 X405.P$7 X405.P$8
Unconnected: IC401.3(!INTA) IC401.7(SQW/!INTB) IC402.7(WC) X404.P$3 X404.P$6 X405.P$3 X405.P$6

## Library data of the parts
0V 5V ADC0 ADC1-ADC7 GND N = test:TEST
C101-C112 C301-C308 C401-C404 = passiv:C_: CAPACITOR, European symbol
D101 D302 D304 D306 D308 D310 D312 D314 D316 = diode:Z-DIODE
D102-D105 D201-D216 = led:LED: LED
D301 D303 D305 D307 D309 D311 D313 D315 D402 D403 = diode:DIODE
D401 = diode:SHOTKY-DIODE
F401 = sicherung:194600-*: Selbstrückstellende Sicherung / PTC-Fuse Datasheet: 194600.pdf <./eagle/doc/sicherung/194600.pdf>
G101 = batterie:KZH20: Knopfzellenhalter
IC101 = ic-mcu:AT90USB1287: Microcontroller Typ Flash SRAM EEPROM GPIO ADC DAC PWM Timer Ports AT90USB1287 <./eagle/doc/ic-mcu/at90usb646_647_1286_1287.pdf> 128kB 8kB 4kB 48 8x 10bit 4x 8bit, 6x 16bit 2x 8bit, 2x 16bit JTAG, USB, USART, I2C, SPI
IC102 = ic-wandler:MAX48*: RS485 TRANSEIVER Datasheet: max1487-max491.pdf <./eagle/doc/ic-wandler/max1487-max491.pdf> Part Number Half- / Fullduplex Datarate (Mbps) Slew-Rate limited Low-Power shutdown Receiver / Driver enable Quiescent current (μA) Number of Receivers un bus MAX481 Half 2.5 No Yes Yes 300 32 MAX483 Half 0.25 Yes Yes Yes 120 32 MAX485 Half 2.5 No No Yes 300 32 MAX487 Half 0.25 Yes Yes Yes 120 128
IC103 = ic-logik:74*166: 8Bit Schiberegister PISO Datasheet: m74hc166.pdf <./eagle/doc/ic-logik/m74hc166.pdf> Pin Bedeutung Beschreibung SI Shift input Serieller Daten eingang CK Cock Daten weiterschieben bei positiver Flanke CKI Cock inhibit Clock bei L freischalten SH/LD Shift / Load L läd bei Clock die Daten CLR Clear Schieberegister wird bei L gelöscht
IC301-IC308 = ic-optokoppler:LTV-356T: Liteon Optokoppler ltv-356t.pdf <./eagle/doc/ic-optokoppler/ltv-356t.pdf>
IC401 = ic-controller:DS1337: Echtzeituhr Datasheet: ds1337.pdf <./eagle/doc/ic-controller/ds1337.pdf>
IC402 = ic-speicher:M24C01*: I2C EEPROM Datasheet: m24c01_02_04_08_16.pdf <./eagle/doc/ic-speicher/m24c01_02_04_08_16.pdf>
K401-K408 = relais:S*02S02: IT(rms) 8A, Zero Cross type SIP 4pin Triac output SSR s102s02.pdf <./eagle/doc/relais/s102s02.pdf>; VDRM: 600
L401 = passiv:L_: INDUCTOR, European symbol
Q101 Q401 = passiv:QM_: SMD Quarz
Q301-Q308 = transistor:PNP2R: PNP Digitaltransistor Typ Variant VCEO (V) IC (mA) PD (mW) R1 (kOhm) R2 (kOhm) Source BCR191 SOT23-BEC -50 -100 200 22 22 bcr191.pdf <./eagle/doc/transistor/bcr191.pdf>
R101-R106 R109-R113 R201-R216 R301-R324 R401 R403-R410 = passiv:R_: RESISTOR, European symbol
R107 R108 = widerstandsnetzwerk:EXB-38V
R402 = sensor:KTY81: Silikon Temperatursensor Datasheet: kty81-1.pdf <./eagle/doc/sensor/kty81-1.pdf> / kty81-2.pdf <./eagle/doc/sensor/kty81-2.pdf>
S101 = schalter:JUMPER
S102 = schalter:KURZHUB
S103 = schalter:DP08: Piano-Dip-Schalter Datasheet: dp.pdf <./eagle/doc/schalter/dp.pdf>
V401 = schaltregler:TME?*: DC/DC Converter TME Series 1 Watt traco_tme.pdf <./eagle/doc/schaltregler/traco_tme.pdf>; MPN: TME 2405S; OC_FARNELL: 1007547; OC_NEWARK: 51R5329
V402 = schaltregler:MEV1S?: DC/DC Converter MEV1 1 Watt kdc_mev.pdf <./eagle/doc/schaltregler/kdc_mev.pdf>
X101 = stecker:USB-MINI
X102 = stecker:AVR_ISP6: HARTING
X103 X303 = anschluss:WS34: Wannenstecker 34polig
X301 X409 = anschluss:AKL_230-02
X302 X304-X307 X401 X402 X407 X408 X410-X412 = anschluss:RIA-73-02
X308 X406 = anschluss:AKL_230-08
X403 = anschluss:AKL_230-04
X404 X405 = stecker:8P8C

## Net classes
1 netz: clearance 3 mm to class 0, clearance 1 mm
2 buspower: clearance 0.5 mm to class 0, clearance 3 mm to class 1, clearance 0.5 mm